# Altium schematic sheet TDII_WIFI_R00.SchDoc
size A4
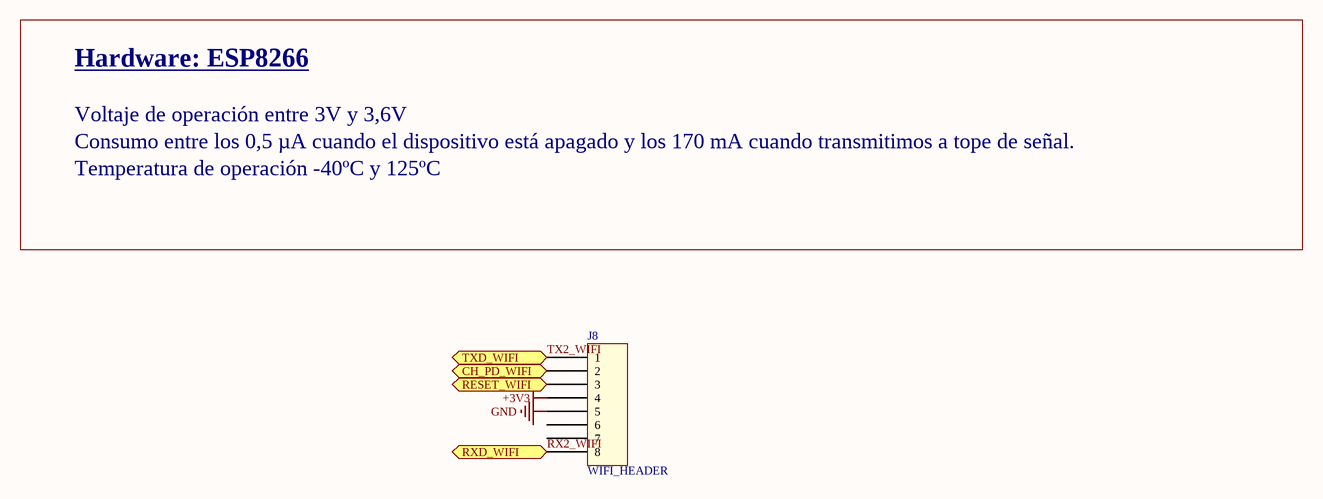
[diagram p0: TDII_WIFI_R00.SchDoc]

## Parts
J8  WIFI_HEADER  [Header_WIFI]

## Ports
CH_PD_WIFI (in), RESET_WIFI (in), RXD_WIFI (in), TXD_WIFI (out)

## Nets
+3V3: J8.4
GND: J8.5
CH_PD_WIFI: J8.2 ; port CH_PD_WIFI
RESET_WIFI: J8.3 ; port RESET_WIFI
RX2_WIFI: J8.8 ; port RXD_WIFI
TX2_WIFI: J8.1 ; port TXD_WIFI

Not connected (* = marked no-connect by the designer): J8 6 7

## Notes on the sheet
- Hardware: ESP8266
- Voltaje de operación entre 3V y 3,6V
- Consumo entre los 0,5 µA cuando el dispositivo está apagado y los 170 mA cuando transmitimos a tope de señal.
- Temperatura de operación -40ºC y 125ºC

## Library data of the parts
J8 = Conector_8 ( 0.100¨)